# EAGLE design I2C_decagon_straight (EAGLE 9.3.0)
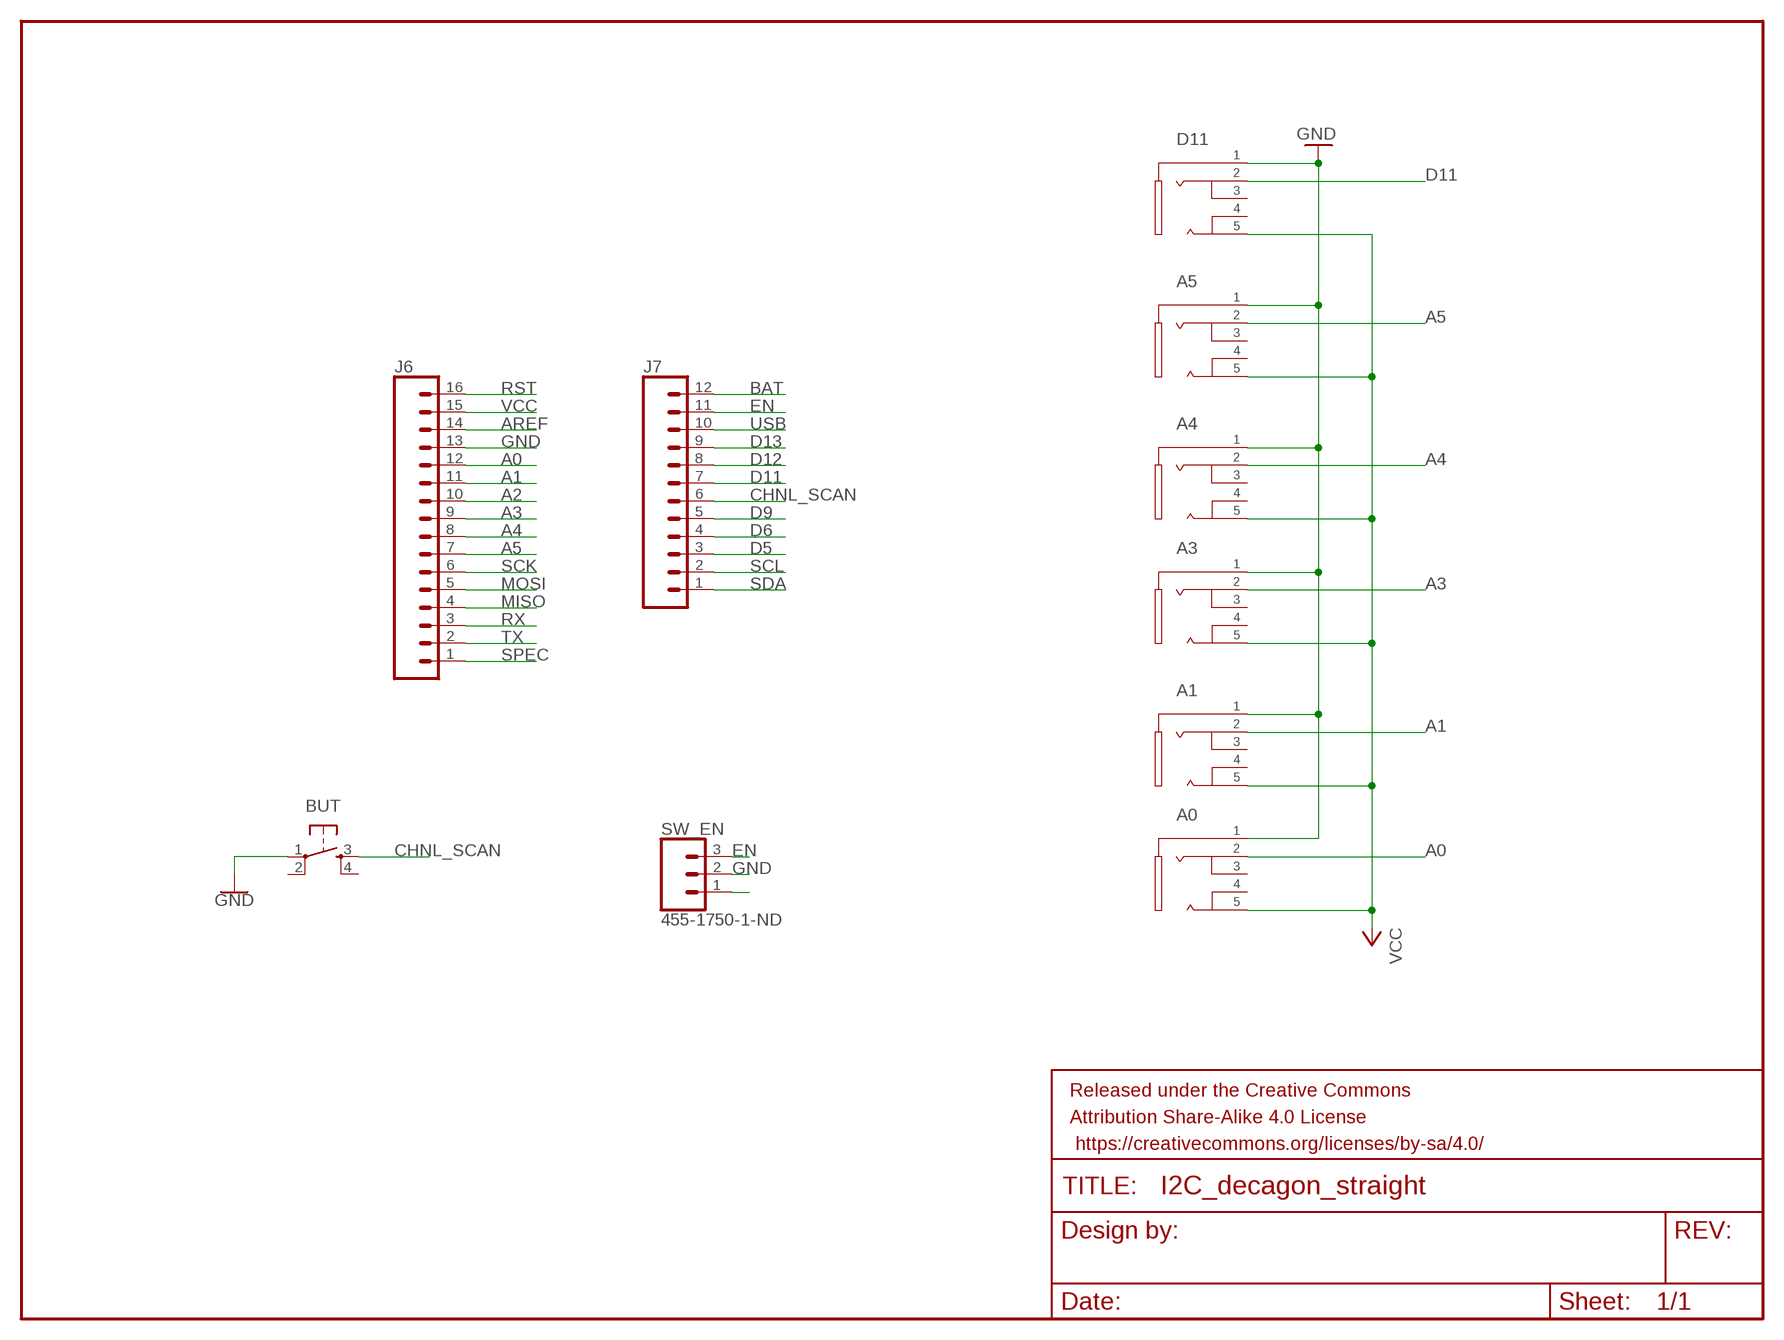
[diagram p0: schematic, sheet 1]

## Parts
A0  JW-PJ-307-5H  [JW-PJ-307-5H]
A1  JW-PJ-307-5H  [JW-PJ-307-5H]
A3  JW-PJ-307-5H  [JW-PJ-307-5H]
A4  JW-PJ-307-5H  [JW-PJ-307-5H]
A5  JW-PJ-307-5H  [JW-PJ-307-5H]
BUT  TAC_SWITCHPTH  [TACTILE-PTH]
D11  JW-PJ-307-5H  [JW-PJ-307-5H]
FRAME1  FRAME-LETTER  [CREATIVE_COMMONS]
J6  CONN_16  [1X16]
J7  CONN_12  [1X12]
SW_EN  455-1750-1-ND  CONN_03  [1X03]

## Nets
A0: A0.2 J6.12
A1: A1.2 J6.11
A2: J6.10
A3: A3.2 J6.9
A4: A4.2 J6.8
A5: A5.2 J6.7
AREF: J6.14
BAT: J7.12
CHNL_SCAN: BUT.3 J7.6
D5: J7.3
D6: J7.4
D9: J7.5
D11: D11.2 J7.7
D12: J7.8
D13: J7.9
EN: J7.11 SW_EN.3
GND: A0.1 A1.1 A3.1 A4.1 A5.1 BUT.1 D11.1 J6.13 SW_EN.2
MISO: J6.4
MOSI: J6.5
N$3: SW_EN.1
RST: J6.16
RX: J6.3
SCK: J6.6
SCL: J7.2
SDA: J7.1
SPEC: J6.1
TX: J6.2
USB: J7.10
VCC: A0.5 A1.5 A3.5 A4.5 A5.5 D11.5 J6.15
Unconnected: A0.3 A0.4 A1.3 A1.4 A3.3 A3.4 A4.3 A4.4 A5.3 A5.4 BUT.2 BUT.4 D11.3 D11.4

## Library data of the parts
A0 A1 A3-A5 D11 = jack:JW-PJ-307-5
BUT = SparkFun-Retired:TAC_SWITCH: Momentary Switch Button commonly used for reset or general input. Spark Fun Electronics SKU : COM-00097 SMT- SWCH-08247
FRAME1 = SparkFun-Aesthetics:FRAME-LETTER: Schematic Frame - Letter Standard 8.5x11 US Letter frame
J6 = SparkFun-Connectors:CONN_16: Multi connection point. Often used as Generic Header-pin footprint for 0.1 inch spaced/style header connections On any of the 0.1 inch spaced packages, you can populate with these: Break Away Headers - Straight <https://www.sparkfun.com/products/116> (PRT-00116) Break Away Male Headers - Right Angle <https://www.sparkfun.com/products/553> (PRT-00553) Female Headers <https://www.sparkfun.com/products/115> (PRT-00115) Break Away Headers - Machine Pin <https://www.sparkfun.com/products/117> (PRT-00117) Break Away Female Headers - Swiss Machine Pin <https://www.sparkfun.com/products/743> (PRT-00743) For SCREWTERMINALS and SPRING TERMINALS visit here: Screw Terimnals on SparkFun.com <https://www.sparkfun.com/search/results?term=Screw+Terminals> (5mm/3.5mm/2.54mm spacing) This device is also useful as a general connection point to wire up your design to another part of your project. Our various solder wires solder well into these plated through hole pads. Hook-Up Wire - Assortment (Stranded, 22 AWG) <https://www.sparkfun.com/products/11375> (PRT-11375) Hook-Up Wire - Assortment (Solid Core, 22 AWG) <https://www.sparkfun.com/products/11367> (PRT-11367) View the entire wire category on our website here <https://www.sparkfun.com/categories/141> Special notes: Molex polarized connector foot print use with SKU : PRT-08231 with associated crimp pins and housings. 1MM SMD Version SKU: PRT-10208 NOTES ON THE VARIANTS LOCK and LOCK_LONGPADS... This footprint was designed to help hold the alignment of a through-hole component (i.e. 6-pin header) while soldering it into place. You may notice that each hole has been shifted either up or down by 0.005 of an inch from it's more standard position (which is a perfectly straight line). This slight alteration caused the pins (the squares in the middle) to touch the edges of the holes. Because they are alternating, it causes a "brace" to hold the component in place. 0.005 has proven to be the perfect amount of "off-center" position when using our standard breakaway headers. Although looks a little odd when you look at the bare footprint, once you have a header in there, the alteration is very hard to notice. Also,if you push a header all the way into place, it is covered up entirely on the bottom side.
J7 = SparkFun-Connectors:CONN_12: Multi connection point. Often used as Generic Header-pin footprint for 0.1 inch spaced/style header connections On any of the 0.1 inch spaced packages, you can populate with these: Break Away Headers - Straight <https://www.sparkfun.com/products/116> (PRT-00116) Break Away Male Headers - Right Angle <https://www.sparkfun.com/products/553> (PRT-00553) Female Headers <https://www.sparkfun.com/products/115> (PRT-00115) Break Away Headers - Machine Pin <https://www.sparkfun.com/products/117> (PRT-00117) Break Away Female Headers - Swiss Machine Pin <https://www.sparkfun.com/products/743> (PRT-00743) For SCREWTERMINALS and SPRING TERMINALS visit here: Screw Terimnals on SparkFun.com <https://www.sparkfun.com/search/results?term=Screw+Terminals> (5mm/3.5mm/2.54mm spacing) This device is also useful as a general connection point to wire up your design to another part of your project. Our various solder wires solder well into these plated through hole pads. Hook-Up Wire - Assortment (Stranded, 22 AWG) <https://www.sparkfun.com/products/11375> (PRT-11375) Hook-Up Wire - Assortment (Solid Core, 22 AWG) <https://www.sparkfun.com/products/11367> (PRT-11367) View the entire wire category on our website here <https://www.sparkfun.com/categories/141> Special notes: Molex polarized connector foot print use with SKU : PRT-08231 with associated crimp pins and housings. 1MM SMD Version SKU: PRT-10208 NOTES ON THE VARIANTS LOCK and LOCK_LONGPADS... This footprint was designed to help hold the alignment of a through-hole component (i.e. 6-pin header) while soldering it into place. You may notice that each hole has been shifted either up or down by 0.005 of an inch from it's more standard position (which is a perfectly straight line). This slight alteration caused the pins (the squares in the middle) to touch the edges of the holes. Because they are alternating, it causes a "brace" to hold the component in place. 0.005 has proven to be the perfect amount of "off-center" position when using our standard breakaway headers. Although looks a little odd when you look at the bare footprint, once you have a header in there, the alteration is very hard to notice. Also,if you push a header all the way into place, it is covered up entirely on the bottom side.
SW_EN = SparkFun-Connectors:CONN_03: Multi connection point. Often used as Generic Header-pin footprint for 0.1 inch spaced/style header connections On any of the 0.1 inch spaced packages, you can populate with these: Break Away Headers - Straight <https://www.sparkfun.com/products/116> (PRT-00116) Break Away Male Headers - Right Angle <https://www.sparkfun.com/products/553> (PRT-00553) Female Headers <https://www.sparkfun.com/products/115> (PRT-00115) Break Away Headers - Machine Pin <https://www.sparkfun.com/products/117> (PRT-00117) Break Away Female Headers - Swiss Machine Pin <https://www.sparkfun.com/products/743> (PRT-00743) Stackable Header - 3 Pin (Female, 0.1") <https://www.sparkfun.com/products/13875> (PRT-13875) For SCREWTERMINALS and SPRING TERMINALS visit here: Screw Terimnals on SparkFun.com <https://www.sparkfun.com/search/results?term=Screw+Terminals> (5mm/3.5mm/2.54mm spacing) This device is also useful as a general connection point to wire up your design to another part of your project. Our various solder wires solder well into these plated through hole pads. Hook-Up Wire - Assortment (Stranded, 22 AWG) <https://www.sparkfun.com/products/11375> (PRT-11375) Hook-Up Wire - Assortment (Solid Core, 22 AWG) <https://www.sparkfun.com/products/11367> (PRT-11367) View the entire wire category on our website here <https://www.sparkfun.com/categories/141> Special notes: Molex polarized connector foot print use with SKU : PRT-08232 with associated crimp pins and housings.; PROD_ID: XXX-00000

## Net classes
0 default: width 0.406 mm
1 ground: width 0.61 mm

## Board
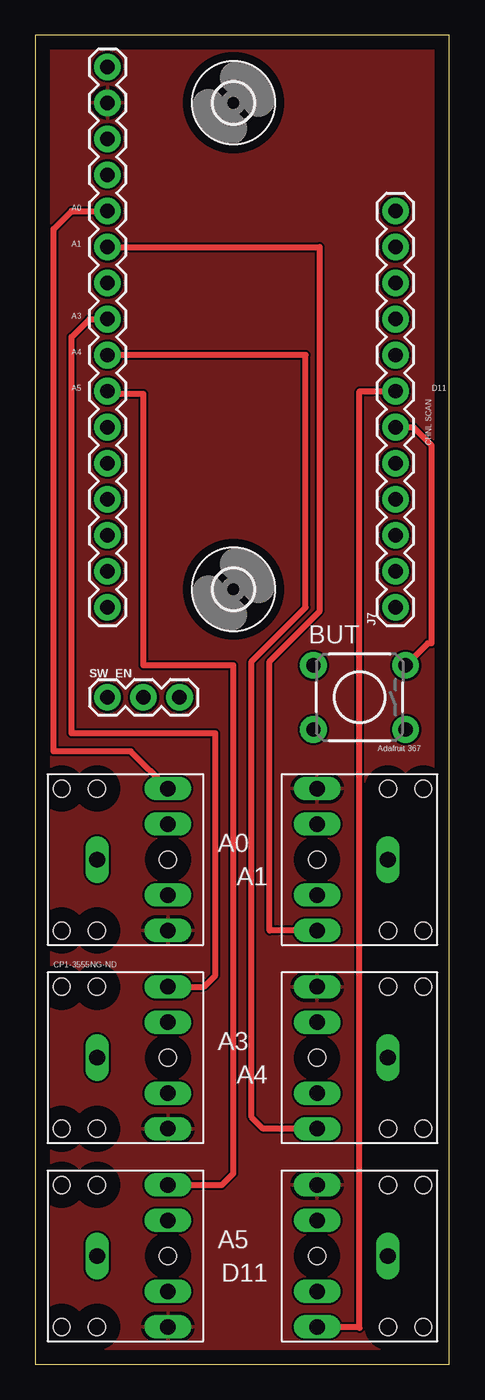
[diagram p1: board, top side]
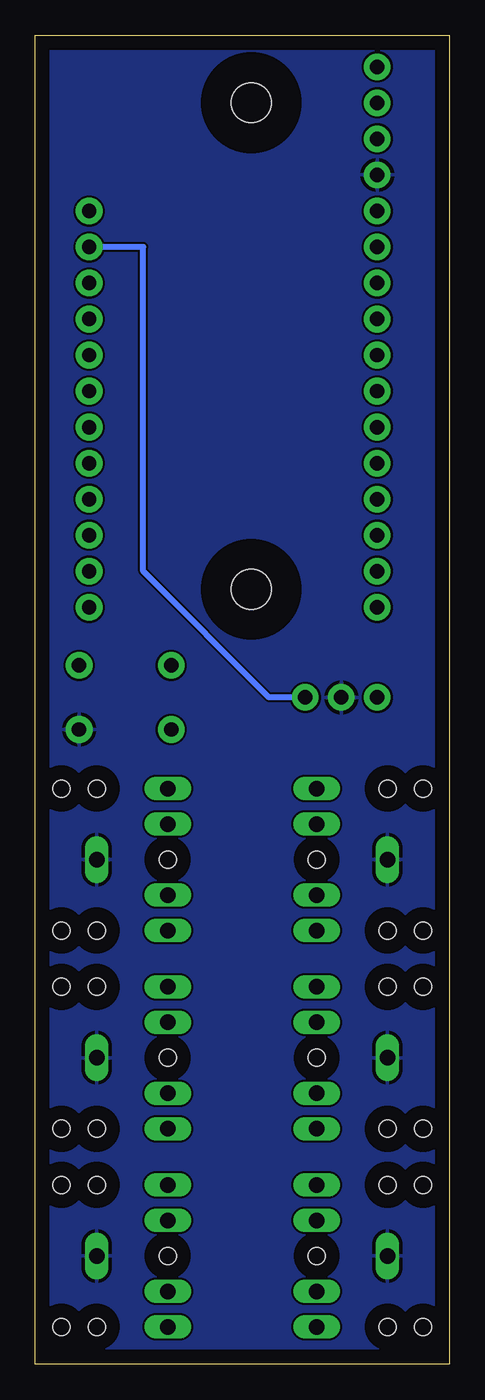
[diagram p2: board, bottom side, seen from below]

Size 29.19 x 93.65 mm. Coordinates in mm from the lower left corner, seen from the top.
Outline: 0,0 29.19,0 29.19,93.65 0,93.65 0,0
Copper layers (1*16): Top 0.035mm / dielectric 1.5mm / Bottom 0.035mm
Design rules "default": minimum track width 6mil, minimum drill 0.35mm, track to track 6mil, track to pad 6mil, pad to pad 6mil, via to via 6mil, smd to smd 6mil, copper to edge 40mil, drill to drill 6mil, minimum pad ring 10mil, minimum via ring 8mil, stop-mask expansion 4mil, vias tented up to drill 0mil, thermal gap 10mil

### Footprints (pad centres in the part's own frame; a part is rotated, then mirrored left to right if it is on the bottom)
JW-PJ-307-5H = drill 1.1 long: 1 -2,0; 2 3,5; 3 3,2.5; 4 3,-2.5; 5 3,-5 | hole 1.2: -4.5,5; -2,5; 3,0; -4.5,-5; -2,-5
TACTILE-PTH = drill 1.016 pad 1.88: 1 -3.251,2.261; 2 3.251,2.261; 3 -3.251,-2.261; 4 3.251,-2.261
1X16 = drill 1.016 pad 1.88: 1 0,0; 2 2.54,0; 3 5.08,0; 4 7.62,0; 5 10.16,0; 6 12.7,0; 7 15.24,0; 8 17.78,0; 9 20.32,0; 10 22.86,0; 11 25.4,0; 12 27.94,0; 13 30.48,0; 14 33.02,0; 15 35.56,0; 16 38.1,0
1X12 = drill 1.016 pad 1.88: 1 0,0; 2 2.54,0; 3 5.08,0; 4 7.62,0; 5 10.16,0; 6 12.7,0; 7 15.24,0; 8 17.78,0; 9 20.32,0; 10 22.86,0; 11 25.4,0; 12 27.94,0
1X03 = drill 1.016 pad 1.88: 1 0,0; 2 2.54,0; 3 5.08,0
2,8 = hole 2.8: 0,0

### Placement (x,y rotation side)
A0  6.35,35.56 0 top
A1  22.86,35.56 180 top
A3  6.35,21.59 0 top
A4  22.86,21.59 180 top
A5  6.35,7.62 0 top
BUT  22.86,46.99 180 top
D11  22.86,7.62 180 top
FRAME1  -80.01,30.48 0 top  (outside the outline)
J6  5.08,53.34 90 top
J7  25.4,53.34 90 top
SW_EN  5.08,46.99 0 top
U$1  [2,8]  13.97,88.9 0 top
U$2  [2,8]  13.97,54.61 0 top

### Tracks (layer width: path | path; a pad name or v marks a point on that pad's centre or on a via)
A0
  Top 0.406: A0.2 6.73,43.18 1.27,43.18 1.27,80.01 2.54,81.28 J6.12
A1
  Top 0.406: A1.2 16.51,30.56 16.51,49.53 20.07,53.09 20.07,78.74 J6.11
A3
  Top 0.406: A3.2 11.89,26.59 12.7,27.4 12.7,44.45 2.54,44.45 2.54,72.39 3.81,73.66 J6.9
A4
  Top 0.406: A4.2 16.05,16.59 15.24,17.41 15.24,49.53 19.05,53.34 19.05,71.12 J6.8
A5
  Top 0.406: A5.2 13.16,12.62 13.97,13.43 13.97,49.25 7.62,49.25 7.62,68.37 5.29,68.37 J6.7
CHNL_SCAN
  Top 0.406: J7.6 26.67,66.04 27.94,64.77 27.94,50.8 27.66,50.8 BUT.3
D11
  Top 0.406: D11.2 22.78,2.62 22.86,2.54 22.86,68.58 J7.7
EN
  Bottom 0.406: SW_EN.3 12.7,46.99 21.59,55.88 21.59,78.74 J7.11
GND
  pour Bottom: 0,93.98 0,0 29.21,0 29.21,93.98
VCC
  pour Top: 0,93.98 0,0 29.21,0 29.21,92.71 27.94,93.98

### Text on the board
tPlace: A0 | A1 | A3 | A4 | A5 | D11 | CHNL SCAN | Adafruit 367 | CP1-3555NG-ND